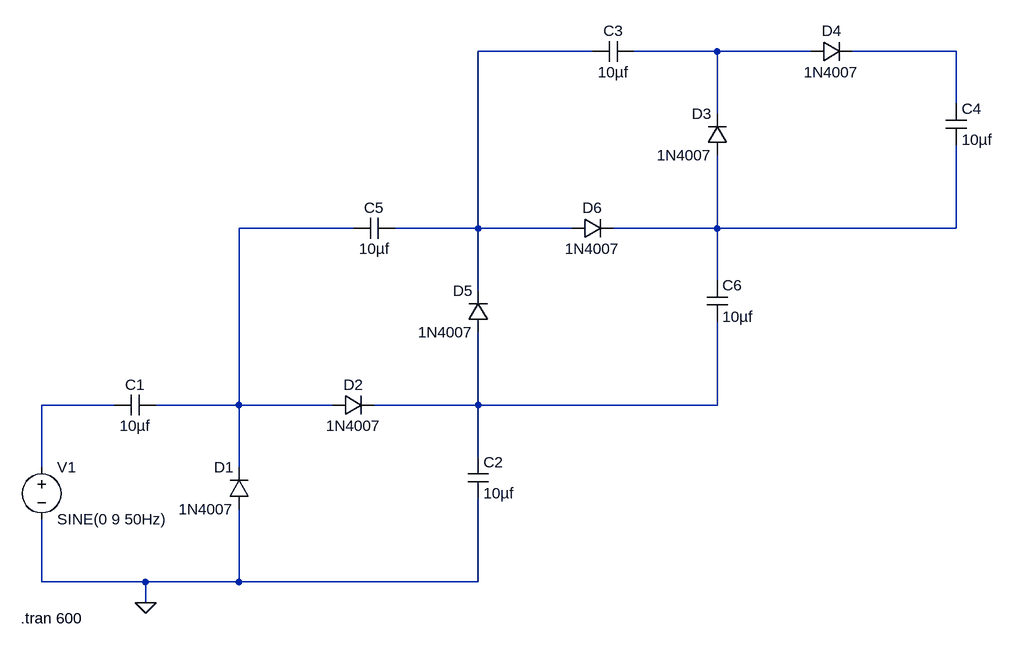
[diagram p0: schematic Day5_Cockroft walton Cascade.asc]
Day5_Cockroft walton Cascade.asc, the LTspice schematic file:
Version 4.1
SHEET 1 1376 680
WIRE 752 -496 576 -496
WIRE 944 -496 816 -496
WIRE 1088 -496 944 -496
WIRE 1312 -496 1152 -496
WIRE 1312 -416 1312 -496
WIRE 944 -400 944 -496
WIRE 384 -224 208 -224
WIRE 576 -224 576 -496
WIRE 576 -224 448 -224
WIRE 720 -224 576 -224
WIRE 944 -224 944 -336
WIRE 944 -224 784 -224
WIRE 1312 -224 1312 -352
WIRE 1312 -224 944 -224
WIRE 944 -144 944 -224
WIRE 576 -128 576 -224
WIRE 16 48 -96 48
WIRE 208 48 208 -224
WIRE 208 48 80 48
WIRE 352 48 208 48
WIRE 576 48 576 -64
WIRE 576 48 416 48
WIRE 944 48 944 -80
WIRE 944 48 576 48
WIRE 576 128 576 48
WIRE -96 144 -96 48
WIRE 208 144 208 48
WIRE -96 320 -96 224
WIRE 64 320 -96 320
WIRE 208 320 208 208
WIRE 208 320 64 320
WIRE 576 320 576 192
WIRE 576 320 208 320
WIRE 64 352 64 320
FLAG 64 352 0
SYMBOL voltage -96 128 R0
WINDOW 123 0 0 Left 0
WINDOW 39 0 0 Left 0
SYMATTR InstName V1
SYMATTR Value SINE(0 9 50Hz)
SYMBOL diode 224 208 R180
WINDOW 0 24 64 Left 2
WINDOW 3 24 0 Left 2
SYMATTR InstName D1
SYMATTR Value 1N4007
SYMBOL cap 80 32 R90
WINDOW 0 0 32 VBottom 2
WINDOW 3 32 32 VTop 2
SYMATTR InstName C1
SYMATTR Value 10µf
SYMBOL diode 352 64 R270
WINDOW 0 32 32 VTop 2
WINDOW 3 0 32 VBottom 2
SYMATTR InstName D2
SYMATTR Value 1N4007
SYMBOL cap 560 128 R0
SYMATTR InstName C2
SYMATTR Value 10µf
SYMBOL diode 592 -64 R180
WINDOW 0 24 64 Left 2
WINDOW 3 24 0 Left 2
SYMATTR InstName D5
SYMATTR Value 1N4007
SYMBOL cap 448 -240 R90
WINDOW 0 0 32 VBottom 2
WINDOW 3 32 32 VTop 2
SYMATTR InstName C5
SYMATTR Value 10µf
SYMBOL diode 720 -208 R270
WINDOW 0 32 32 VTop 2
WINDOW 3 0 32 VBottom 2
SYMATTR InstName D6
SYMATTR Value 1N4007
SYMBOL cap 928 -144 R0
SYMATTR InstName C6
SYMATTR Value 10µf
SYMBOL diode 960 -336 R180
WINDOW 0 24 64 Left 2
WINDOW 3 24 0 Left 2
SYMATTR InstName D3
SYMATTR Value 1N4007
SYMBOL cap 816 -512 R90
WINDOW 0 0 32 VBottom 2
WINDOW 3 32 32 VTop 2
SYMATTR InstName C3
SYMATTR Value 10µf
SYMBOL diode 1088 -480 R270
WINDOW 0 32 32 VTop 2
WINDOW 3 0 32 VBottom 2
SYMATTR InstName D4
SYMATTR Value 1N4007
SYMBOL cap 1296 -416 R0
SYMATTR InstName C4
SYMATTR Value 10µf
TEXT -128 376 Left 2 !.tran 600

The netlist it stands for:
* Day5_Cockroft walton Cascade.asc
V1 N006 0 SINE(0 9 50Hz)
D1 0 N004 1N4007
C1 N004 N006 10µf
D2 N004 N007 1N4007
C2 N007 0 10µf
D5 N007 N001 1N4007
C5 N001 N004 10µf
D6 N001 N005 1N4007
C6 N005 N007 10µf
D3 N005 N002 1N4007
C3 N002 N001 10µf
D4 N002 N003 1N4007
C4 N003 N005 10µf
.model D D
.lib standard.dio
.tran 600
.backanno
.end